# Altium schematic sheet ADCS C2Sv0.1_TopLevel.SchDoc
size A3; SheetNumber: 1; SheetTotal: 7
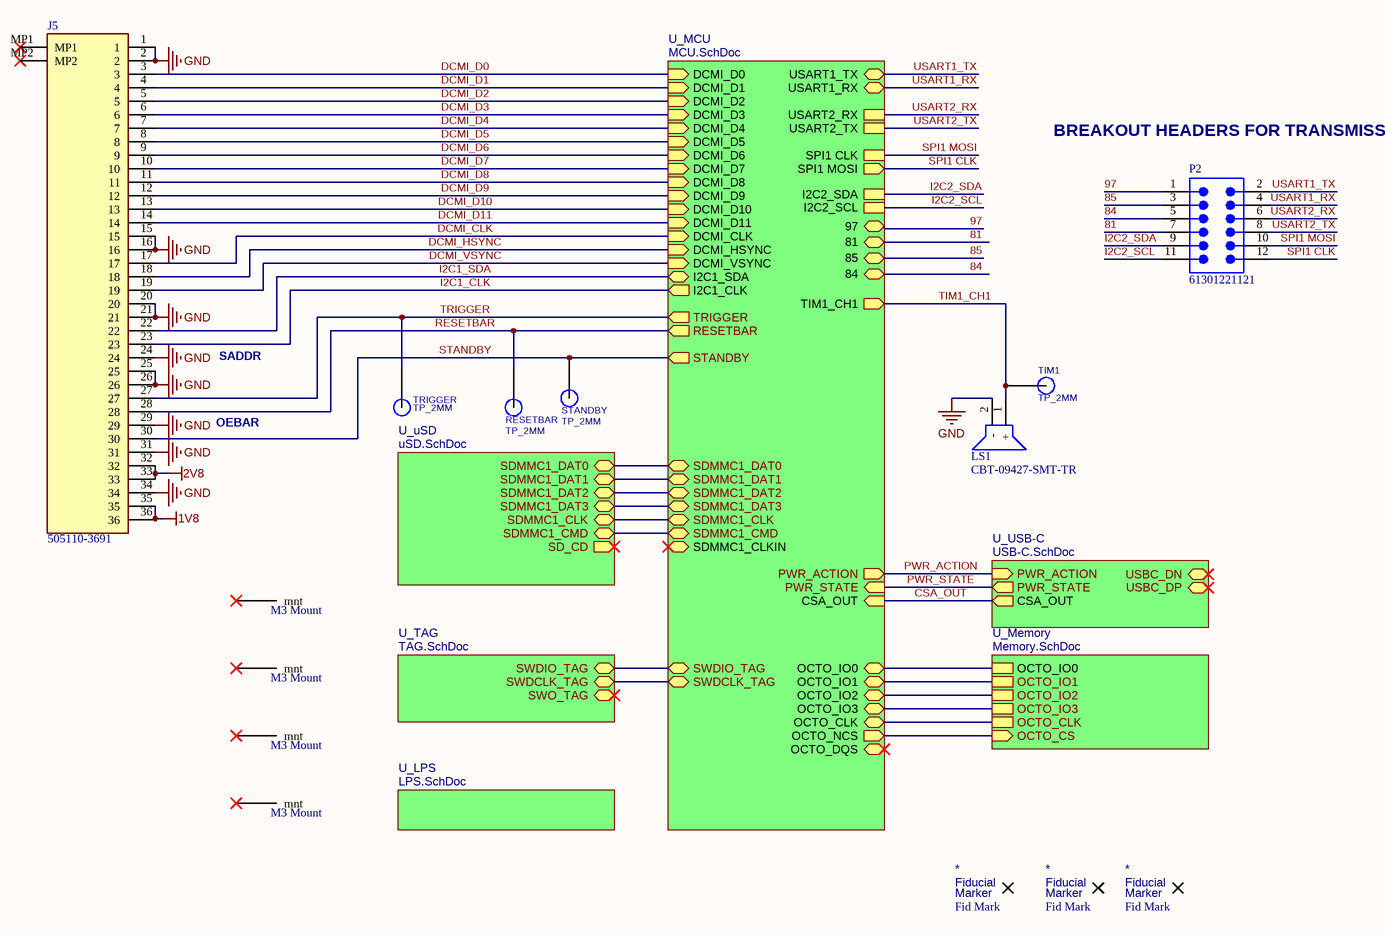
[diagram p0: ADCS C2Sv0.1_TopLevel.SchDoc]

## Parts
(Parts that share a designator on the sheet are numbered #1, #2 ... from top to bottom, then left to right.)
*#1  Fid Mark  [Fid Marker]
*#2  Fid Mark  [Fid Marker]
*#3  Fid Mark  [Fid Marker]
J5  505110-3691  [5051103691]
LS1  CBT-09427-SMT-TR  [CBT09427SMTTR]
MNT1  M3 Mount  [M3_Mount-Footprint-1]
MNT2  M3 Mount  [M3_Mount-Footprint-1]
MNT3  M3 Mount  [M3_Mount-Footprint-1]
MNT4  M3 Mount  [M3_Mount-Footprint-1]
P2  61301221121  [61301221121]
RESETBAR  TP_2MM  [TESTPOINT 2MM]
STANDBY  TP_2MM  [TESTPOINT 2MM]
TIM1  TP_2MM  [TESTPOINT 2MM]
TRIGGER  TP_2MM  [TESTPOINT 2MM]

## Sub-sheets
U_LPS = LPS.SchDoc: no entries
U_MCU = MCU.SchDoc: SDMMC1_DAT0 (bidir), SDMMC1_DAT1 (bidir), SDMMC1_DAT2 (bidir), SDMMC1_DAT3 (bidir), SDMMC1_CLK (bidir), SDMMC1_CMD (bidir), RESETBAR (out), TRIGGER (out), STANDBY (out), SWDIO_TAG (bidir), SWDCLK_TAG (bidir), PWR_STATE (in), PWR_ACTION (out), SDMMC1_CLKIN (bidir), I2C1_SDA (bidir), I2C1_CLK (out), DCMI_D5 (in), USART1_RX (bidir), USART1_TX (bidir), DCMI_D8 (in), DCMI_D9 (in), DCMI_D11 (in), OCTO_IO3 (bidir), OCTO_IO0 (bidir), OCTO_IO1 (bidir), DCMI_HSYNC (in), DCMI_CLK (in), DCMI_D7 (in), DCMI_D6 (in), DCMI_D4 (in), OCTO_DQS (bidir), TIM1_CH1 (out), DCMI_D2 (in), SPI1 MOSI (out), DCMI_D1 (in), DCMI_D0 (in), DCMI_D3 (in), SPI1 CLK, DCMI_D10 (in), I2C2_SDA, I2C2_SCL, OCTO_CLK (bidir), OCTO_NCS (out), USART2_RX, USART2_TX, OCTO_IO2 (bidir), DCMI_VSYNC (in), CSA_OUT (in), 97 (bidir), 81 (bidir), 85 (bidir), 84 (bidir)
U_Memory = Memory.SchDoc: OCTO_CS (in), OCTO_CLK, OCTO_IO1, OCTO_IO2, OCTO_IO3, OCTO_IO0
U_TAG = TAG.SchDoc: SWDIO_TAG (bidir), SWDCLK_TAG (bidir), SWO_TAG (bidir)
U_USB-C = USB-C.SchDoc: PWR_STATE (out), PWR_ACTION (in), USBC_DN (bidir), USBC_DP (bidir), CSA_OUT (out)
U_uSD = uSD.SchDoc: SD_CD (out), SDMMC1_DAT3 (bidir), SDMMC1_DAT2 (bidir), SDMMC1_DAT1 (bidir), SDMMC1_DAT0 (bidir), SDMMC1_CLK (bidir), SDMMC1_CMD (bidir)

## Nets
1V8: J5.35 J5.36
2V8: J5.32 J5.33
GND: J5.1 J5.2 J5.15 J5.16 J5.20 J5.21 J5.24 J5.25 J5.26 J5.29 J5.31 J5.34 LS1.2(-)
81: P2.7 ; sheet U_MCU/81
84: P2.5 ; sheet U_MCU/84
85: P2.3 ; sheet U_MCU/85
97: P2.1 ; sheet U_MCU/97
CSA_OUT: sheet U_MCU/CSA_OUT, sheet U_USB-C/CSA_OUT
DCMI_CLK: J5.17 ; sheet U_MCU/DCMI_CLK
DCMI_D0: J5.3 ; sheet U_MCU/DCMI_D0
DCMI_D1: J5.4 ; sheet U_MCU/DCMI_D1
DCMI_D2: J5.5 ; sheet U_MCU/DCMI_D2
DCMI_D3: J5.6 ; sheet U_MCU/DCMI_D3
DCMI_D4: J5.7 ; sheet U_MCU/DCMI_D4
DCMI_D5: J5.8 ; sheet U_MCU/DCMI_D5
DCMI_D6: J5.9 ; sheet U_MCU/DCMI_D6
DCMI_D7: J5.10 ; sheet U_MCU/DCMI_D7
DCMI_D8: J5.11 ; sheet U_MCU/DCMI_D8
DCMI_D9: J5.12 ; sheet U_MCU/DCMI_D9
DCMI_D10: J5.13 ; sheet U_MCU/DCMI_D10
DCMI_D11: J5.14 ; sheet U_MCU/DCMI_D11
DCMI_HSYNC: J5.18 ; sheet U_MCU/DCMI_HSYNC
DCMI_VSYNC: J5.19 ; sheet U_MCU/DCMI_VSYNC
I2C1_CLK: J5.23 ; sheet U_MCU/I2C1_CLK
I2C1_SDA: J5.22 ; sheet U_MCU/I2C1_SDA
I2C2_SCL: P2.11 ; sheet U_MCU/I2C2_SCL
I2C2_SDA: P2.9 ; sheet U_MCU/I2C2_SDA
PWR_ACTION: sheet U_MCU/PWR_ACTION, sheet U_USB-C/PWR_ACTION
PWR_STATE: sheet U_MCU/PWR_STATE, sheet U_USB-C/PWR_STATE
RESETBAR: J5.28 RESETBAR.TP(TP_2MM) ; sheet U_MCU/RESETBAR
SPI1 CLK: P2.12 ; sheet U_MCU/SPI1 MOSI
SPI1 MOSI: P2.10 ; sheet U_MCU/SPI1 CLK
STANDBY: J5.30 STANDBY.TP(TP_2MM) ; sheet U_MCU/STANDBY
TIM1_CH1: LS1.1(+) TIM1.TP(TP_2MM) ; sheet U_MCU/TIM1_CH1
TRIGGER: J5.27 TRIGGER.TP(TP_2MM) ; sheet U_MCU/TRIGGER
USART1_RX: P2.4 ; sheet U_MCU/USART1_RX
USART1_TX: P2.2 ; sheet U_MCU/USART1_TX
USART2_RX: P2.6 ; sheet U_MCU/USART2_RX
USART2_TX: P2.8 ; sheet U_MCU/USART2_TX
(unnamed): sheet U_MCU/SDMMC1_DAT0, sheet U_uSD/SDMMC1_DAT0
(unnamed): sheet U_MCU/SDMMC1_DAT1, sheet U_uSD/SDMMC1_DAT1
(unnamed): sheet U_MCU/SDMMC1_DAT2, sheet U_uSD/SDMMC1_DAT2
(unnamed): sheet U_MCU/SDMMC1_DAT3, sheet U_uSD/SDMMC1_DAT3
(unnamed): sheet U_MCU/SDMMC1_CLK, sheet U_uSD/SDMMC1_CLK
(unnamed): sheet U_MCU/SDMMC1_CMD, sheet U_uSD/SDMMC1_CMD
(unnamed): sheet U_MCU/SWDIO_TAG, sheet U_TAG/SWDIO_TAG
(unnamed): sheet U_MCU/SWDCLK_TAG, sheet U_TAG/SWDCLK_TAG
(unnamed): sheet U_MCU/OCTO_IO3, sheet U_Memory/OCTO_IO3
(unnamed): sheet U_MCU/OCTO_IO0, sheet U_Memory/OCTO_IO0
(unnamed): sheet U_MCU/OCTO_IO1, sheet U_Memory/OCTO_IO1
(unnamed): sheet U_MCU/OCTO_CLK, sheet U_Memory/OCTO_CLK
(unnamed): sheet U_MCU/OCTO_NCS, sheet U_Memory/OCTO_CS
(unnamed): sheet U_MCU/OCTO_IO2, sheet U_Memory/OCTO_IO2

Not connected (* = marked no-connect by the designer): J5 MP1* MP2*; MNT1 1(mnt)*; MNT2 1(mnt)*; MNT3 1(mnt)*; MNT4 1(mnt)*

## Notes on the sheet
- (near P2) BREAKOUT HEADERS FOR TRANSMISSION
- SADDR
- OEBAR
- Title:
- Version:
- Revision:
- Perth Aerospace Student Team
- Size:
- Date:
- A3
- Project:
- Sheet
- of
- Author:
- Approved By:
- Curtin University
- Kent Street, Bentley
- Western Australia, 6152
- File:
- (in symbol Fid Mark) Fiducial; Marker

## Library data of the parts
J5 = 505110-3691: Connector; Manufacturer_Name: Molex; Datasheet Link: https://www.molex.com/content/dam/molex/molex-dot-com/products/automated/en-us/salesdrawingpdf/505/505110/5051103691_sd.pdf; Height: 2.1mm; Manufacturer_Part_Number: 505110-3691; Mouser Part Number: N/A; Mouser Price/Stock: https://www.mouser.com/Search/Refine.aspx?Keyword=N%2FA
LS1 = CBT-09427-SMT-TR: Loudspeaker or Buzzer; Manufacturer_Name: Same Sky; Datasheet Link: https://www.sameskydevices.com/product/resource/cbt-09427-smt-tr.pdf; Height: 2.7mm; Manufacturer_Part_Number: CBT-09427-SMT-TR; Mouser Part Number: 490-CBT-09427-SMT-TR; Mouser Price/Stock: https://www.mouser.co.uk/ProductDetail/Same-Sky/CBT-09427-SMT-TR?qs=3yDvfGtJnUwSpp62uPMpGQ%3D%3D; Arrow Part Number: CBT-09427-SMT-TR; Arrow Price/Stock: https://www.arrow.com/en/products/cbt-09427-smt-tr/cui-devices?region=nac
MNT1-MNT4 = CMP-002-00124-2: M3 mounting hole; Author: Raphael Ho
P2 = CMP-096-000204-1: WR-PHD Pin Header, THT, Vertical, pitch 2.54mm, 2 Row, 12P; Manufacturer: Wurth Elektronik; Rated Current: 3A; Working Voltage: 250V; Withstanding Voltage: 500V; Contact Resistance: 20mOhm; Mount: Through Hole; ComponentLink2URL: https://www.we-online.com/redexpert/spec/61301221121?ad; Pitch: 2.54mm; Category: Board-to-Board Connectors; Source: WR-PHD.SchLib; ComponentLink2Description: Datasheet Link; Match Code: WR-PHD; Packaging: Bag; Operating Temperature Min: -40°C; Number of Pins: 12; Design Item ID: 61301221121; Number of Rows: 2; ComponentLink1URL: https://www.we-online.com/redexpert/article/61301221121?ad; Pin Count: 12; Component Type: Standard; Manufacturer Part Number: 61301221121; ComponentLink1Description: Website Link; Orientation: Vertical; Gender: Pin Header; Operating Temperature Max: 105°C